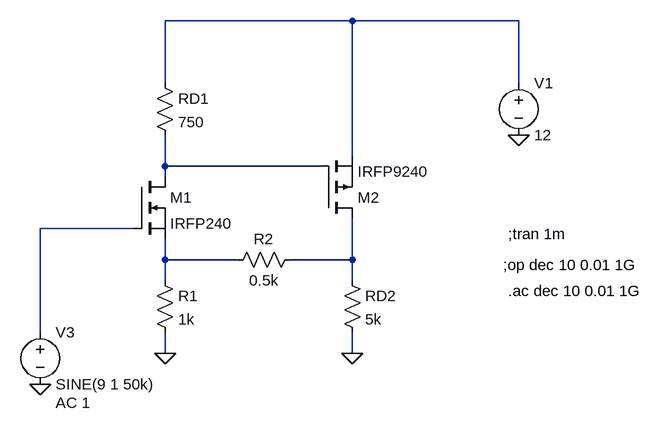
[diagram p0: schematic Feedback Amplifier MOS.asc]
Feedback Amplifier MOS.asc, the LTspice schematic file:
Version 4
SHEET 1 1076 680
WIRE 320 -16 32 -16
WIRE 576 -16 320 -16
WIRE 32 80 32 -16
WIRE 576 80 576 -16
WIRE 320 192 320 -16
WIRE 32 208 32 160
WIRE 272 208 32 208
WIRE 32 224 32 208
WIRE -16 304 -160 304
WIRE 32 352 32 320
WIRE 144 352 32 352
WIRE 320 352 320 288
WIRE 320 352 224 352
WIRE 32 384 32 352
WIRE 320 384 320 352
WIRE -160 464 -160 304
WIRE 32 496 32 464
WIRE 320 496 320 464
FLAG -160 544 0
FLAG 576 160 0
FLAG 32 496 0
FLAG 320 496 0
SYMBOL res 16 64 R0
SYMATTR InstName RD1
SYMATTR Value 750
SYMBOL res 16 368 R0
SYMATTR InstName R1
SYMATTR Value 1k
SYMBOL res 304 368 R0
SYMATTR InstName RD2
SYMATTR Value 5k
SYMBOL res 240 336 R90
WINDOW 0 0 56 VBottom 2
WINDOW 3 32 56 VTop 2
SYMATTR InstName R2
SYMATTR Value 0.5k
SYMBOL voltage 576 64 R0
WINDOW 123 0 0 Left 0
WINDOW 39 0 0 Left 0
SYMATTR InstName V1
SYMATTR Value 12
SYMBOL nmos -16 224 R0
SYMATTR InstName M1
SYMATTR Value IRFP240
SYMBOL pmos 272 288 M180
SYMATTR InstName M2
SYMATTR Value IRFP9240
SYMBOL voltage -160 448 R0
WINDOW 123 24 124 Left 2
WINDOW 39 0 0 Left 0
SYMATTR Value2 AC 1
SYMATTR InstName V3
SYMATTR Value SINE(9 1 50k)
TEXT 560 312 Left 2 !;tran 1m
TEXT 552 360 Left 2 !;op dec 10 0.01 1G
TEXT 560 400 Left 2 !.ac dec 10 0.01 1G

The netlist it stands for:
* Feedback Amplifier MOS.asc
RD1 N001 N002 750
R1 N004 0 1k
RD2 N005 0 5k
R2 N005 N004 0.5k
V1 N001 0 12
M1 N002 N003 N004 N004 IRFP240
M2 N005 N002 N001 N001 IRFP9240
V3 N003 0 SINE(9 1 50k) AC 1
.model NMOS NMOS
.model PMOS PMOS
.lib standard.mos
;tran 1m
;op dec 10 0.01 1G
.ac dec 10 0.01 1G
.backanno
.end